# EAGLE design remote (EAGLE 6.3)
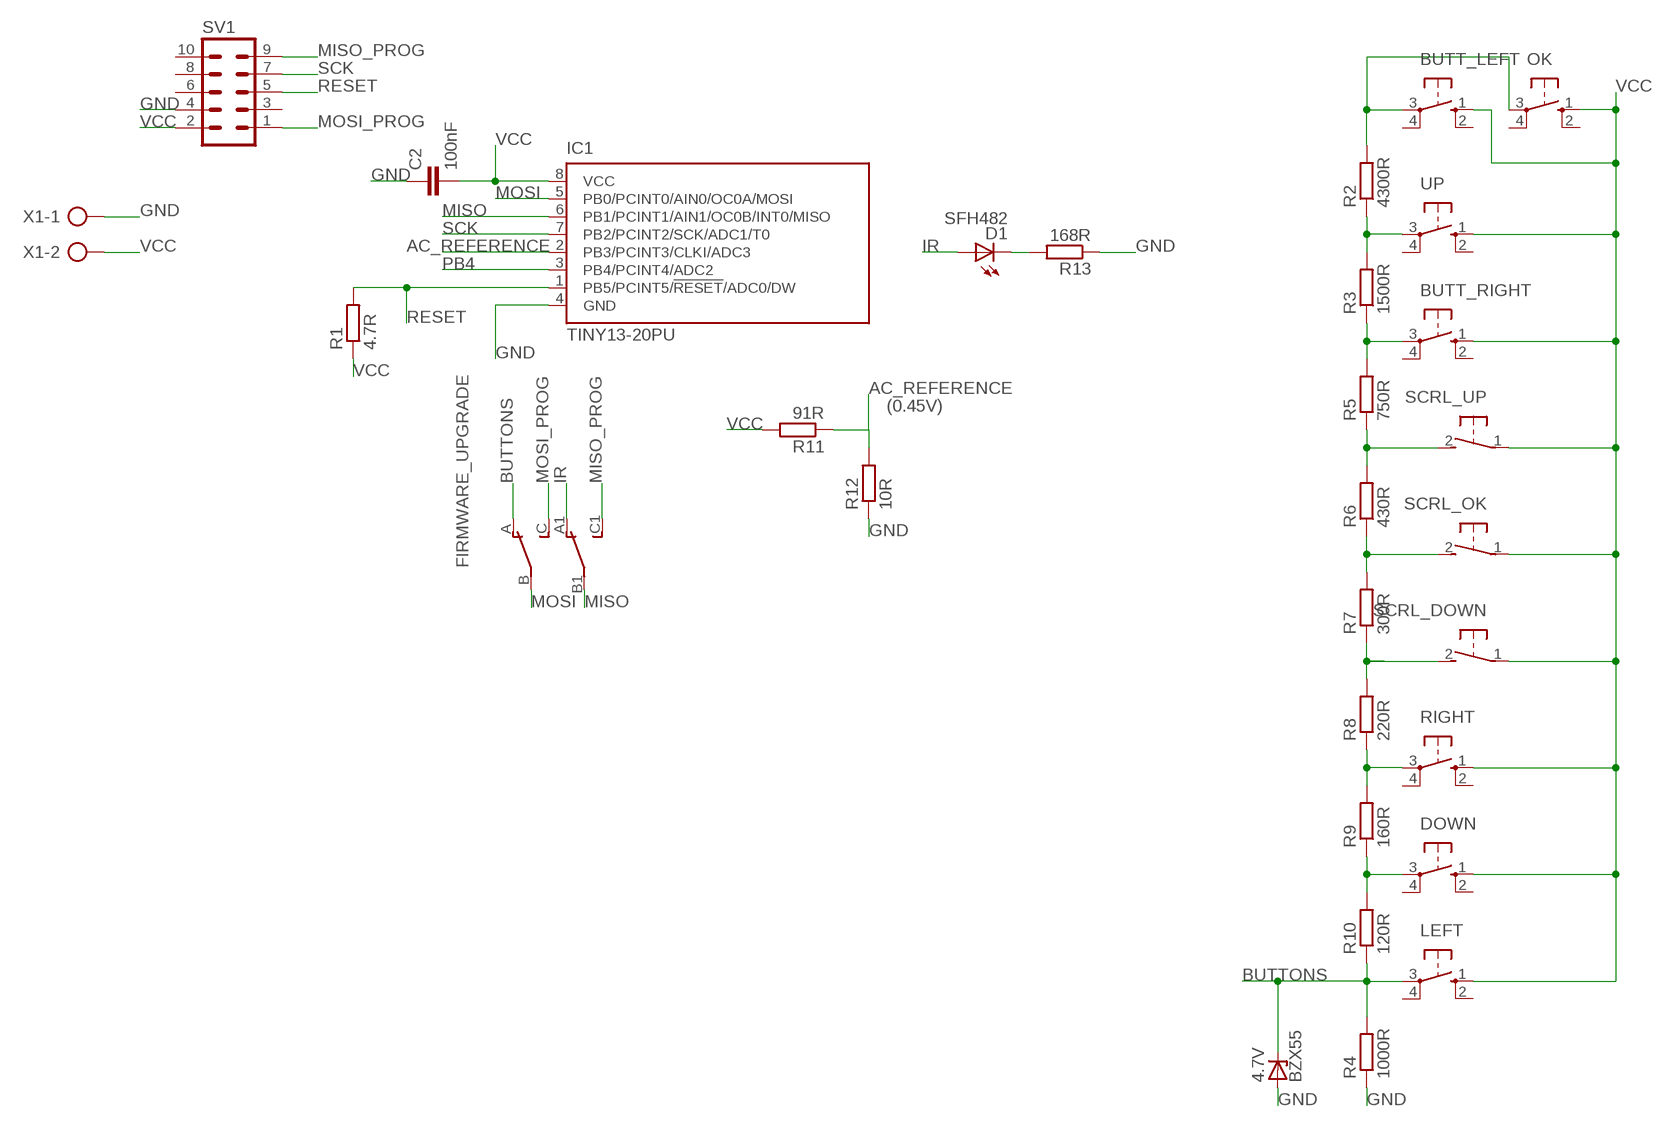
[diagram p0: schematic, sheet 1]

## Parts
4.7V  BZX55  [DO35Z10]
BUTT_LEFT  10-XX  [B3F-10XX]
BUTT_RIGHT  10-XX  [B3F-10XX]
C2  100nF  C-EU050-024X044  [C050-024X044]
D1  SFH482  [SFH482]
DOWN  10-XX  [B3F-10XX]
FIRMWARE_UPGRADE  MINI_SLIDING_SWITCHS  [MINI_SLIDING_SWITCH]
IC1  TINY13-20PU  [DIL08]
LEFT  10-XX  [B3F-10XX]
OK  10-XX  [B3F-10XX]
R1  4.7R  R-EU_0204/7  [0204/7]
R2  4300R  R-EU_0204/7  [0204/7]
R3  1500R  R-EU_0204/7  [0204/7]
R4  1000R  R-EU_0204/7  [0204/7]
R5  750R  R-EU_0204/7  [0204/7]
R6  430R  R-EU_0204/7  [0204/7]
R7  300R  R-EU_0204/7  [0204/7]
R8  220R  R-EU_0204/7  [0204/7]
R9  160R  R-EU_0204/7  [0204/7]
R10  120R  R-EU_0204/7  [0204/7]
R11  91R  R-EU_0204/7  [0204/7]
R12  10R  R-EU_0204/7  [0204/7]
R13  168R  R-EU_0204/7  [0204/7]
RIGHT  10-XX  [B3F-10XX]
SCRL_DOWN  31-XX  [B3F-31XX]
SCRL_OK  31-XX  [B3F-31XX]
SCRL_UP  31-XX  [B3F-31XX]
SV1  ML10L  [ML10L]
UP  10-XX  [B3F-10XX]
X1  AK300/2  [AK300/2]

## Nets
AC_REFERENCE: IC1.2(PB3/PCINT3/CLKI/ADC3) R11.1 R12.2
BUTTONS: 4.7V.C FIRMWARE_UPGRADE.A LEFT.3(P) R4.2 R10.1
GND: 4.7V.A C2.1 IC1.4(GND) R4.1 R12.1 R13.1 SV1.4 X1.1
IR: D1.A FIRMWARE_UPGRADE.A1
MISO: FIRMWARE_UPGRADE.B1 IC1.6(PB1/PCINT1/AIN1/OC0B/INT0/MISO)
MISO_PROG: FIRMWARE_UPGRADE.C1 SV1.9
MOSI: FIRMWARE_UPGRADE.B IC1.5(PB0/PCINT0/AIN0/OC0A/MOSI)
MOSI_PROG: FIRMWARE_UPGRADE.C SV1.1
N$5: R2.1 R3.2 UP.3(P)
N$6: BUTT_LEFT.3(P) OK.3(P) R2.2
N$7: R6.1 R7.2 SCRL_OK.2(S)
N$8: R7.1 R8.2 SCRL_DOWN.2(S)
N$9: R8.1 R9.2 RIGHT.3(P)
N$10: DOWN.3(P) R9.1 R10.2
N$11: D1.K(C) R13.2
N$12: R5.1 R6.2 SCRL_UP.2(S)
N$111: BUTT_RIGHT.3(P) R3.1 R5.2
PB4: IC1.3(PB4/PCINT4/ADC2)
RESET: IC1.1(PB5/PCINT5/!RESET!/ADC0/DW) R1.2 SV1.5
SCK: IC1.7(PB2/PCINT2/SCK/ADC1/T0) SV1.7
VCC: BUTT_LEFT.1(S) BUTT_RIGHT.1(S) C2.2 DOWN.1(S) IC1.8(VCC) LEFT.1(S) OK.1(S) R1.1 R11.2 RIGHT.1(S) SCRL_DOWN.1(P) SCRL_OK.1(P) SCRL_UP.1(P) SV1.2 UP.1(S) X1.2
Unconnected: BUTT_LEFT.2(S1) BUTT_LEFT.4(P1) BUTT_RIGHT.2(S1) BUTT_RIGHT.4(P1) DOWN.2(S1) DOWN.4(P1) LEFT.2(S1) LEFT.4(P1) OK.2(S1) OK.4(P1) RIGHT.2(S1) RIGHT.4(P1) SV1.3 SV1.6 SV1.8 SV1.10 UP.2(S1) UP.4(P1)

## Notes on the sheet
- (0.45V)

## Library data of the parts
4.7V = diode:BZX55: Z DIODE
BUTT_LEFT BUTT_RIGHT DOWN LEFT OK RIGHT UP = switch-omron:10-XX: OMRON SWITCH; MPN: B3F-1000; OC_FARNELL: 176432; OC_NEWARK: 36M3542
C2 = resistor:C-EU: CAPACITOR, European symbol
D1 = led:SFH482: IR LED infrared emitting diode, Infineon
FIRMWARE_UPGRADE = mini_sliding_switch:MINI_SLIDING_SWITCH: SLIDING SWITCH 0.1" spacing through hole, vertical SPDT slide switch http://www.ladyada.net/library/pcb/eaglelibrary.html
IC1 = atmel:TINY13: 8-bit AVR Microcontroller with 1K Bytes In-System Programmable Flash Source: http://www.atmel.com/dyn/resources/prod_documents/2535S.pdf; MPN: ATTINY13-20PU; OC_FARNELL: 9171550; OC_NEWARK: 96K6521
R1 = resistor:R-EU_: RESISTOR, European symbol
R2-R13 = rcl:R-EU_: RESISTOR, European symbol
SCRL_DOWN SCRL_OK SCRL_UP = switch-omron:31-XX: OMRON SWITCH; MPN: B3F-3100; OC_FARNELL: 959704; OC_NEWARK: 36M3582
SV1 = con-harting-ml:ML10: HARTING; OC_FARNELL: unknown; OC_NEWARK: unknown
X1 = con-ptr500:AK300/2: CONNECTOR; OC_FARNELL: unknown; OC_NEWARK: unknown

## Board
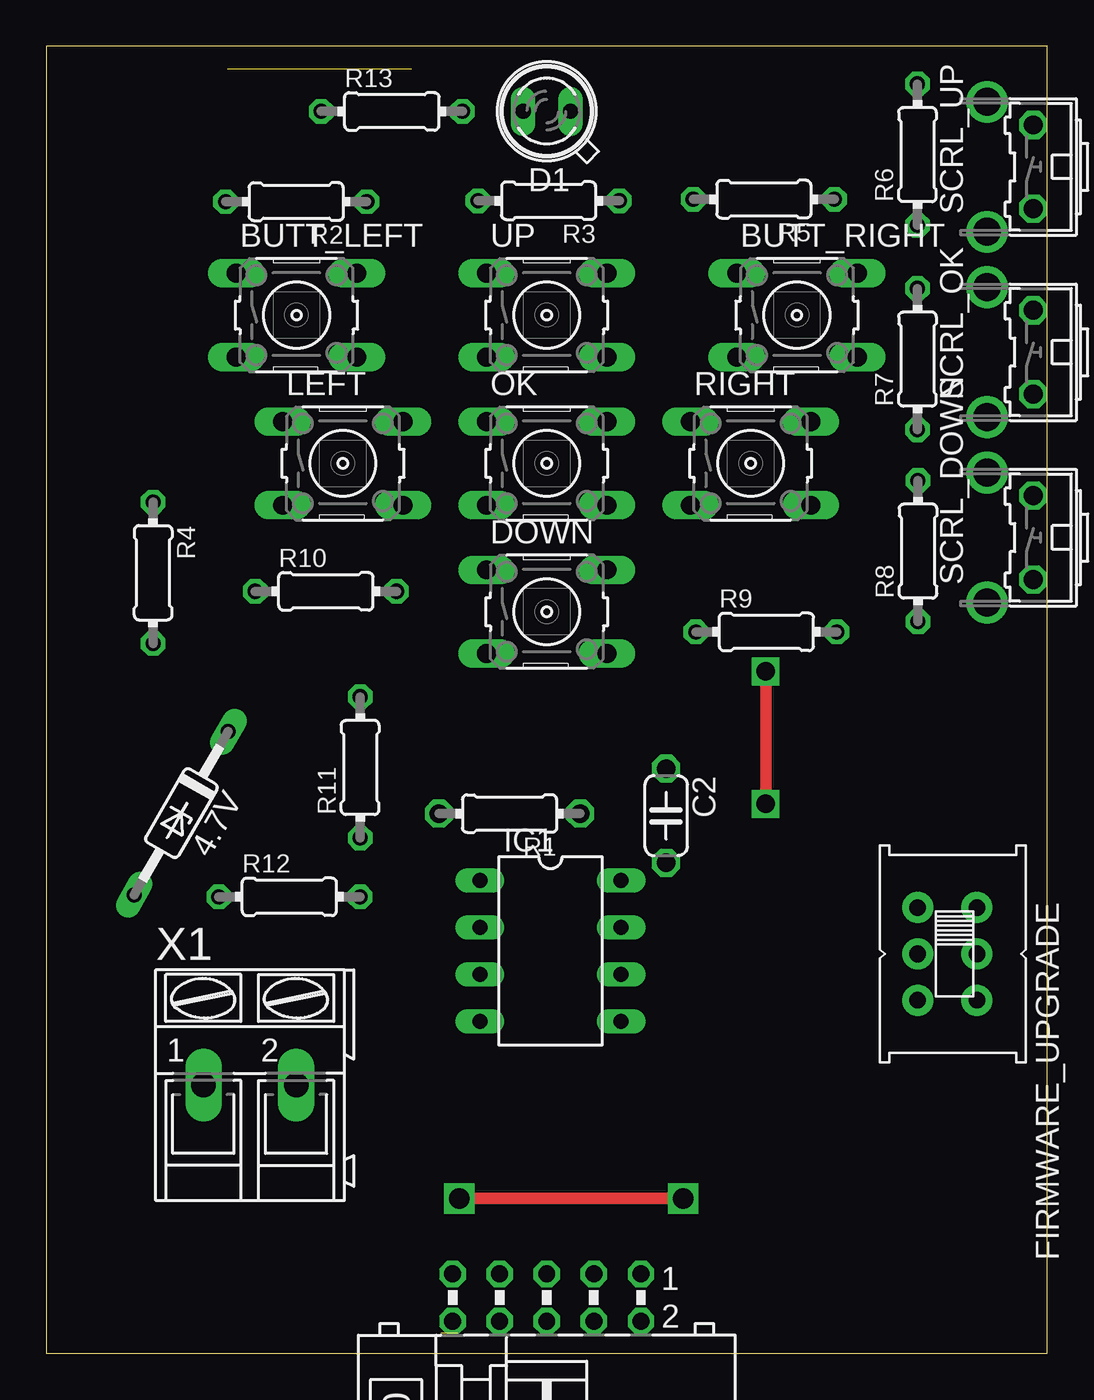
[diagram p1: board, top side]
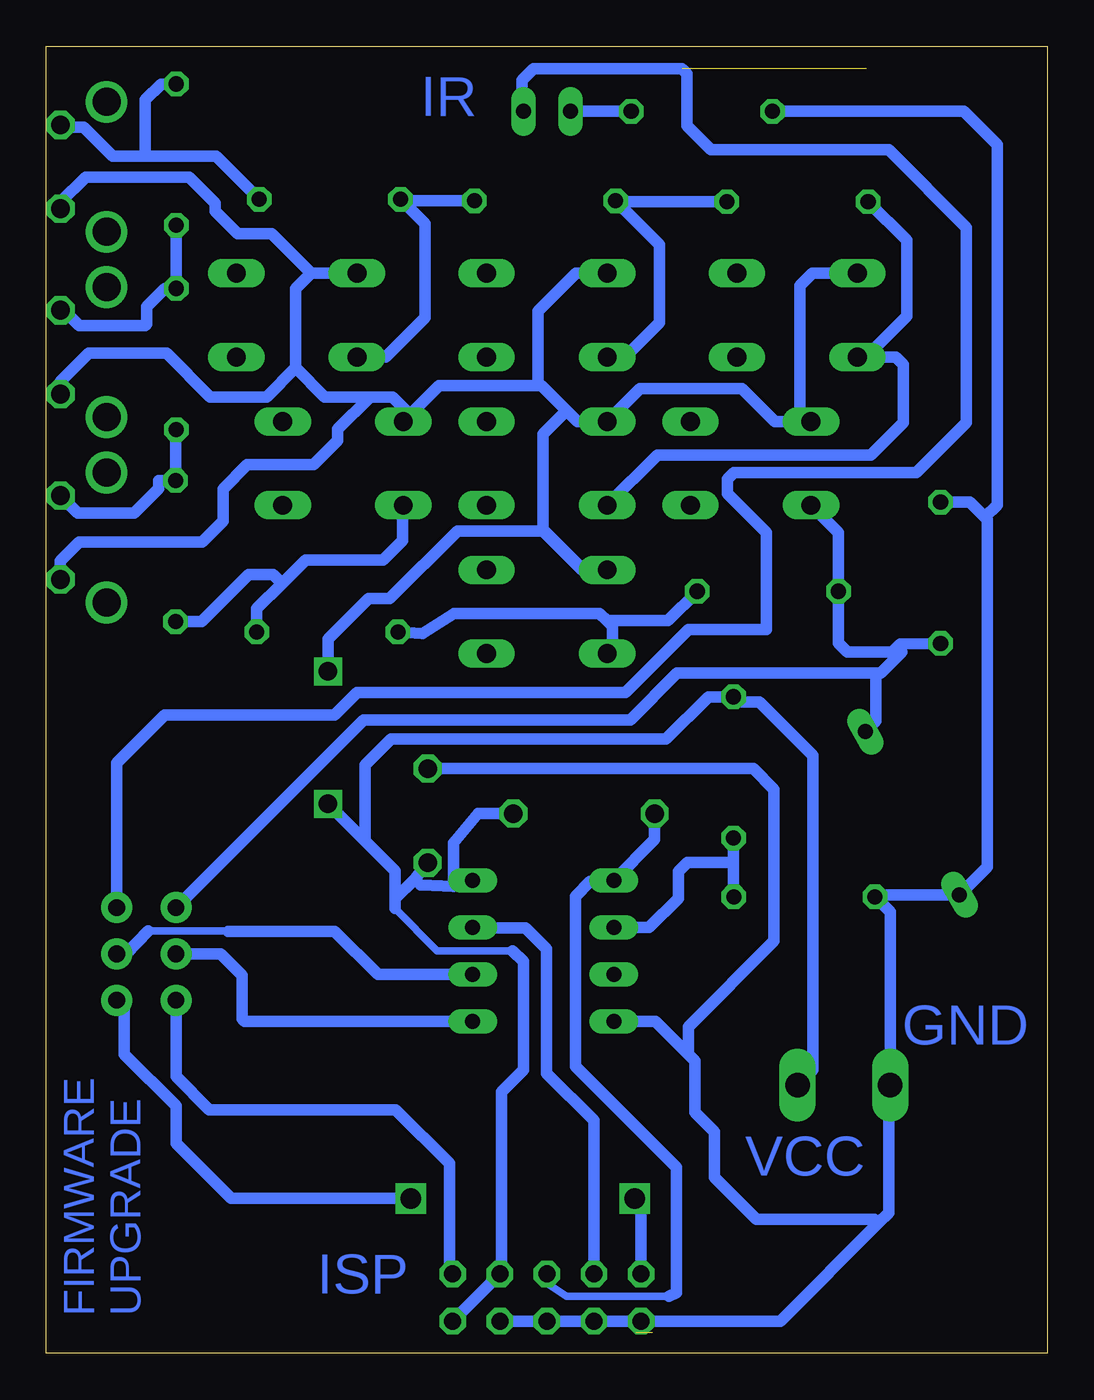
[diagram p2: board, bottom side, seen from below]

Size 54 x 70.5 mm. Coordinates in mm from the lower left corner, seen from the top.
Outline: 0,0 54,0 54,70.5 0,70.5 0,0
Copper layers (1*16): Top 0.035mm / dielectric 1.5mm / Bottom 0.035mm
Design rules "default": minimum track width 10mil, minimum drill 24mil, track to track 8mil, track to pad 8mil, pad to pad 8mil, via to via 8mil, smd to smd 8mil, copper to edge 40mil, drill to drill 8mil, minimum pad ring 10mil, minimum via ring 8mil, stop-mask expansion 4mil, vias tented up to drill 0mil, thermal gap 10mil

### Footprints (pad centres in the part's own frame; a part is rotated, then mirrored left to right if it is on the bottom)
DO35Z10 = drill 0.813 long: A 5.08,0; C -5.08,0
B3F-10XX = drill 1.016 long: 1 -3.251,2.261; 2 3.251,2.261; 3 -3.251,-2.261; 4 3.251,-2.261
C050-024X044 = drill 1 octagon: 1 -2.54,0; 2 2.54,0
SFH482 = drill 0.813 long: A -1.27,0; K 1.27,0
MINI_SLIDING_SWITCH = drill 0.9 pad 1.676: A -2.5,0; A1 -2.5,3.2; B 0,0; B1 0,3.2; C 2.5,0; C1 2.5,3.2
DIL08 = drill 0.813 long: 1 -3.81,-3.81; 2 -1.27,-3.81; 3 1.27,-3.81; 4 3.81,-3.81; 5 3.81,3.81; 6 1.27,3.81; 7 -1.27,3.81; 8 -3.81,3.81
0204/7 = drill 1 octagon: 1 -3.81,0; 2 3.81,0
0204/7' = drill 0.813 octagon: 1 -3.81,0; 2 3.81,0
B3F-31XX = drill 1.016 octagon: 1 -2.261,-1.245; 2 2.261,-1.245 | drill 1.499 pad 2.159: 3 -3.505,1.245; 4 3.505,1.245
ML10L = drill 0.914 octagon: 1 -5.08,-1.27; 2 -5.08,1.27; 3 -2.54,-1.27; 4 -2.54,1.27; 5 0,-1.27; 6 0,1.27; 7 2.54,-1.27; 8 2.54,1.27; 9 5.08,-1.27; 10 5.08,1.27
AK300/2 = drill 1.321 long: 1 -2.515,0; 2 2.489,0

### Placement (x,y rotation side)
4.7V  7.28,29.13 240 top
BUTT_LEFT  13.5,56 0 top
BUTT_RIGHT  40.5,56 0 top
C2  33.44,29 270 top
D1  27,67 180 top
DOWN  27,40 0 top
FIRMWARE_UPGRADE  47.01,21.54 270 top
IC1  27.2,21.7 270 top
LEFT  16,48 0 top
OK  27,48 0 top
R1  24.99,29.11 180 top
R2  4300R  [0204/7']  13.48,62.12 180 top
R3  1500R  [0204/7']  27.1,62.17 180 top
R4  1000R  [0204/7']  5.76,42.1 270 top
R5  750R  [0204/7']  38.71,62.25 180 top
R6  430R  [0204/7']  47,64.66 90 top
R7  300R  [0204/7']  47,53.63 90 top
R8  220R  [0204/7']  47.03,43.27 90 top
R9  160R  [0204/7']  38.85,38.91 0 top
R10  120R  [0204/7']  15.08,41.1 0 top
R11  91R  [0204/7']  16.93,31.6 90 top
R12  10R  [0204/7']  13.11,24.62 0 top
R13  168R  [0204/7']  18.64,66.99 0 top
RIGHT  38,48 0 top
SCRL_DOWN  52,44 90 top
SCRL_OK  52,54 90 top
SCRL_UP  52,64 90 top
SV1  27,3 180 top
UP  27,56 0 top
X1  10.99,14.46 0 top

### Tracks (layer width: path | path; a pad name or v marks a point on that pad's centre or on a via)
AC_REFERENCE
  Bottom 0.61: IC1.2 21.48,22.97 19.91,24.54 19.91,25.98 19.43,26.46 17.11,26.46 16.93,26.28 | R11.1 16.93,26.28 | 16.93,26.28 R12.2
BUTTONS
  Bottom 0.61: FIRMWARE_UPGRADE.A 36.89,34.16 22.5,34.16 19.97,36.69 9.24,36.69 | 9.24,36.69 8.98,36.69 7.85,37.82 8.37,37.82 | 8.37,37.82 10.79,37.82 11.27,38.3 R10.1 11.27,44.26 LEFT.3 | R4.2 7.94,38.25 8.37,37.82 | 4.7V.C 9.24,34.11 9.24,36.69
GND
  Bottom 0.61: SV1.4 14.4,1.73 9.11,7.02 | 9.11,7.02 8.55,7.58 8.55,14.38 X1.1 8.47,23.8 R12.1 9.19,24.73 4.7V.A 3.23,26.24 3.23,44.97 3.36,45.1 | IC1.4 21.13,17.89 19.36,16.12 | 19.36,16.12 19.01,15.77 19.01,12.99 17.96,11.94 17.96,9.49 15.7,7.23 9.32,7.23 9.11,7.02 | R4.1 4.17,45.91 3.36,45.1 | R13.1 4.5,66.99 2.7,65.19 2.7,45.76 3.36,45.1 | C2.1 15.87,31.54 14.74,30.41 14.74,22.23 19.36,17.61 19.36,16.12
IR  (1 unrouted)
  Bottom 0.61: FIRMWARE_UPGRADE.A1 50.21,31.83 47.62,34.42 38.46,34.42 37.24,35.64 22.76,35.64 19.36,39.04 15.17,39.04 15.17,44.27 17.27,46.37 17.27,47.15 16.92,47.5 7.06,47.5 4.36,50.2 4.36,60.73 8.55,64.92 18.14,64.92 19.45,66.23 19.45,69.02 19.71,69.28 27.73,69.28 28.34,68.67 28.34,67.07 D1.A
MISO
  Bottom 0.406: 48.5,22.78 44.22,22.78 44.2,22.76
  Bottom 0.61: IC1.6 36.12,20.43 38.45,22.76 44.2,22.76 | FIRMWARE_UPGRADE.B1 49.7,21.54 48.5,22.78
MISO_PROG  (via drill 1.1)
  Top 0.61: v22.27,8.35 v34.35,8.35
  Bottom 0.61: SV1.9 21.92,8 v22.27,8.35 | 50.42,18.83 FIRMWARE_UPGRADE.C1 49.8,18.63 49.8,16.12 47.01,13.33 47.01,11.33 44.03,8.35 v34.35,8.35
MOSI
  Bottom 0.61: IC1.5 43.31,17.89 43.45,18.03 43.45,20.39 44.6,21.54 FIRMWARE_UPGRADE.B
MOSI_PROG
  Bottom 0.61: FIRMWARE_UPGRADE.C 47.01,14.92 45.22,13.13 35.16,13.13 32.26,10.23 32.26,4.45 SV1.1
N$3  (1 unrouted)
N$5
  Bottom 0.61: R3.2 23.24,62.12 | 23.24,62.12 R2.1 | 23.24,62.12 20.93,59.81 20.93,55.6 22.79,53.74 UP.3
N$6
  Bottom 0.61: R2.2 7.59,60.04 7.59,55.95 9.8,53.74 BUTT_LEFT.3 8.17,53.74 7.76,53.33 7.76,50.2 9.51,48.45 21.04,48.45 OK.3
N$7
  Bottom 0.61: R6.1 R7.2 47.61,57.44 48.58,56.47 48.58,55.51 48.66,55.43 52.24,55.43 53.07,56.26 SCRL_OK.2
N$8
  Bottom 0.61: R7.1 47.03,49.79 R8.2 47.94,47.08 47.94,46.65 49.27,45.32 52.3,45.32 SCRL_DOWN.2
N$9
  Bottom 0.61: R9.2 42.66,40.16 41.3,41.52 | 41.3,41.52 40.03,42.79 35.85,42.79 34.8,43.84 34.8,45.69 RIGHT.3 | R8.1 45.63,39.46 43.08,42.01 41.78,42.01 41.3,41.52
N$10
  Bottom 0.61: R9.1 33.7,38.83 32.01,39.91 24.15,39.91 23.77,39.52 | 23.77,39.52 23.46,39.22 23.46,38.03 DOWN.3 | R10.2 20.46,39.52 23.77,39.52
N$11
  Bottom 0.61: D1.K R13.2
N$12
  Bottom 0.61: R6.2 47.82,68.47 48.66,67.63 48.66,64.58 | R5.1 44.85,64.58 48.66,64.58 | 48.66,64.58 50.42,64.58 51.98,66.14 53.12,66.14 SCRL_UP.2
N$111
  Bottom 0.61: R5.2 34.82,62.17 | 34.82,62.17 R3.1 | 34.82,62.17 33.58,60.93 33.58,55.86 35.7,53.74 BUTT_RIGHT.3
RESET
  Bottom 0.406: SV1.5 27,3.78 25.94,3.06 20.42,3.06
  Bottom 0.61: 20.42,3.06 20.02,3.26 20.02,10.03 25.47,15.48 25.47,24.65 24.67,25.45 23.45,25.45 IC1.1 21.18,27.72 R1.2
SCK
  Bottom 0.61: SV1.7 24.46,12.55 27.01,15.1 27.01,21.8 28.15,22.94 30.98,22.94 IC1.7
VCC  (via drill 1)
  Top 0.61: v38.81,36.78 v38.81,29.63
  Bottom 0.406: 28.86,21.71 32.92,21.71 35.19,23.99
  Bottom 0.61: 32.04,25.18 33.81,25.27 34.13,25.59 | 32.04,25.18 31.25,25.27 IC1.8 | C2.2 34.13,25.59 | 32.04,25.18 32.04,27.52 30.72,29.11 R1.1 | SV1.2 29.45,4.36 29.45,14.09 28.27,15.27 28.27,21.13 28.86,21.71 | 35.19,23.99 35.19,24.52 | 35.19,24.52 34.13,25.59 | BUTT_LEFT.1 12.68,58.26 13.34,57.6 13.34,50.85 LEFT.1 14.71,50.26 16.48,52.03 21.98,52.03 OK.1 25.36,50.26 25.95,50.85 | 25.95,50.85 27.3,52.2 27.47,52.2 | 27.47,52.2 32.81,52.2 34.37,50.64 | 34.37,50.64 RIGHT.1 | UP.1 25.42,58.26 27.47,56.21 27.47,52.2 | BUTT_RIGHT.1 39.72,58.26 | 39.72,58.26 40.55,57.43 40.55,53.16 | 40.55,53.16 38.98,51.59 36.54,51.59 | 36.54,51.59 35.32,51.59 34.37,50.64 | 25.95,50.85 27.21,49.59 27.21,44.36 25.11,42.26 DOWN.1 25.02,42.26 27.12,44.36 31.83,44.36 35.49,40.7 36.63,40.7 38.81,38.52 v38.81,36.78 | SCRL_UP.1 53.24,62.09 51.89,63.44 46.3,63.44 44.91,62.05 44.91,61.61 43.69,60.39 41.85,60.39 39.72,58.26 | SCRL_OK.1 53.24,52.41 51.71,53.94 47.52,53.94 45.17,51.59 42.12,51.59 40.55,53.16 | SCRL_DOWN.1 53.24,42.74 52.24,43.75 45.61,43.75 44.48,44.88 44.48,46.62 43.17,47.93 39.59,47.93 38.28,49.24 38.28,49.85 36.54,51.59 | v38.81,29.63 36.8,27.62 | 36.8,27.62 35.19,26.01 35.19,24.52 | 36.8,27.62 36.8,27.63 36.8,31.72 35.4,33.12 20.58,33.12 18.29,35.41 R11.2 16.64,35.12 15.53,35.12 12.65,32.24 12.65,15.29 X1.2

### Text on the board
Bottom: IR | GND | VCC | ISP | FIRMWARE / UPGRADE